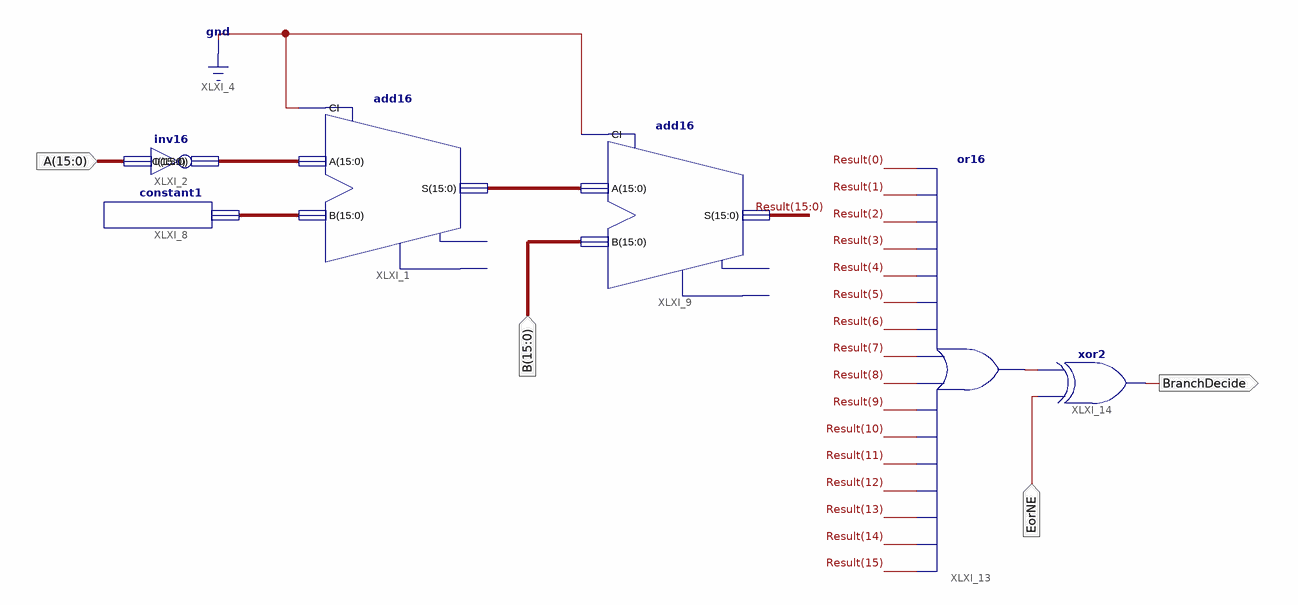
[diagram p0: schematic sheet 1]
// Xilinx ISE schematic comparator.sch (spartan3adsp) as structural Verilog: 6 symbols, 4 ports
module comparator (
  input  [15:0] A,
  input  [15:0] B,
  input  EorNE,
  output BranchDecide
);

  wire XLXN_43;
  wire [15:0] Result, XLXN_1, XLXN_13, XLXN_18;

  add16 XLXI_1 (.A(XLXN_1), .B(XLXN_13), .CI(1'b0), .S(XLXN_18));  // open: CO, OFL
  inv16 XLXI_2 (.I(A), .O(XLXN_1));
  constant1 XLXI_8 (.O(XLXN_13));
  add16 XLXI_9 (.A(XLXN_18), .B(B), .CI(1'b0), .S(Result));  // open: CO, OFL
  or XLXI_13 (XLXN_43, Result[15], Result[14], Result[13], Result[12], Result[11], Result[10], Result[9], Result[8], Result[7], Result[6], Result[5], Result[4], Result[3], Result[2], Result[1], Result[0]);
  xor XLXI_14 (BranchDecide, EorNE, XLXN_43);
endmodule
